# Altium schematic sheet Sheet1.SchDoc
size A3; SheetNumber: 1; SheetTotal: 1
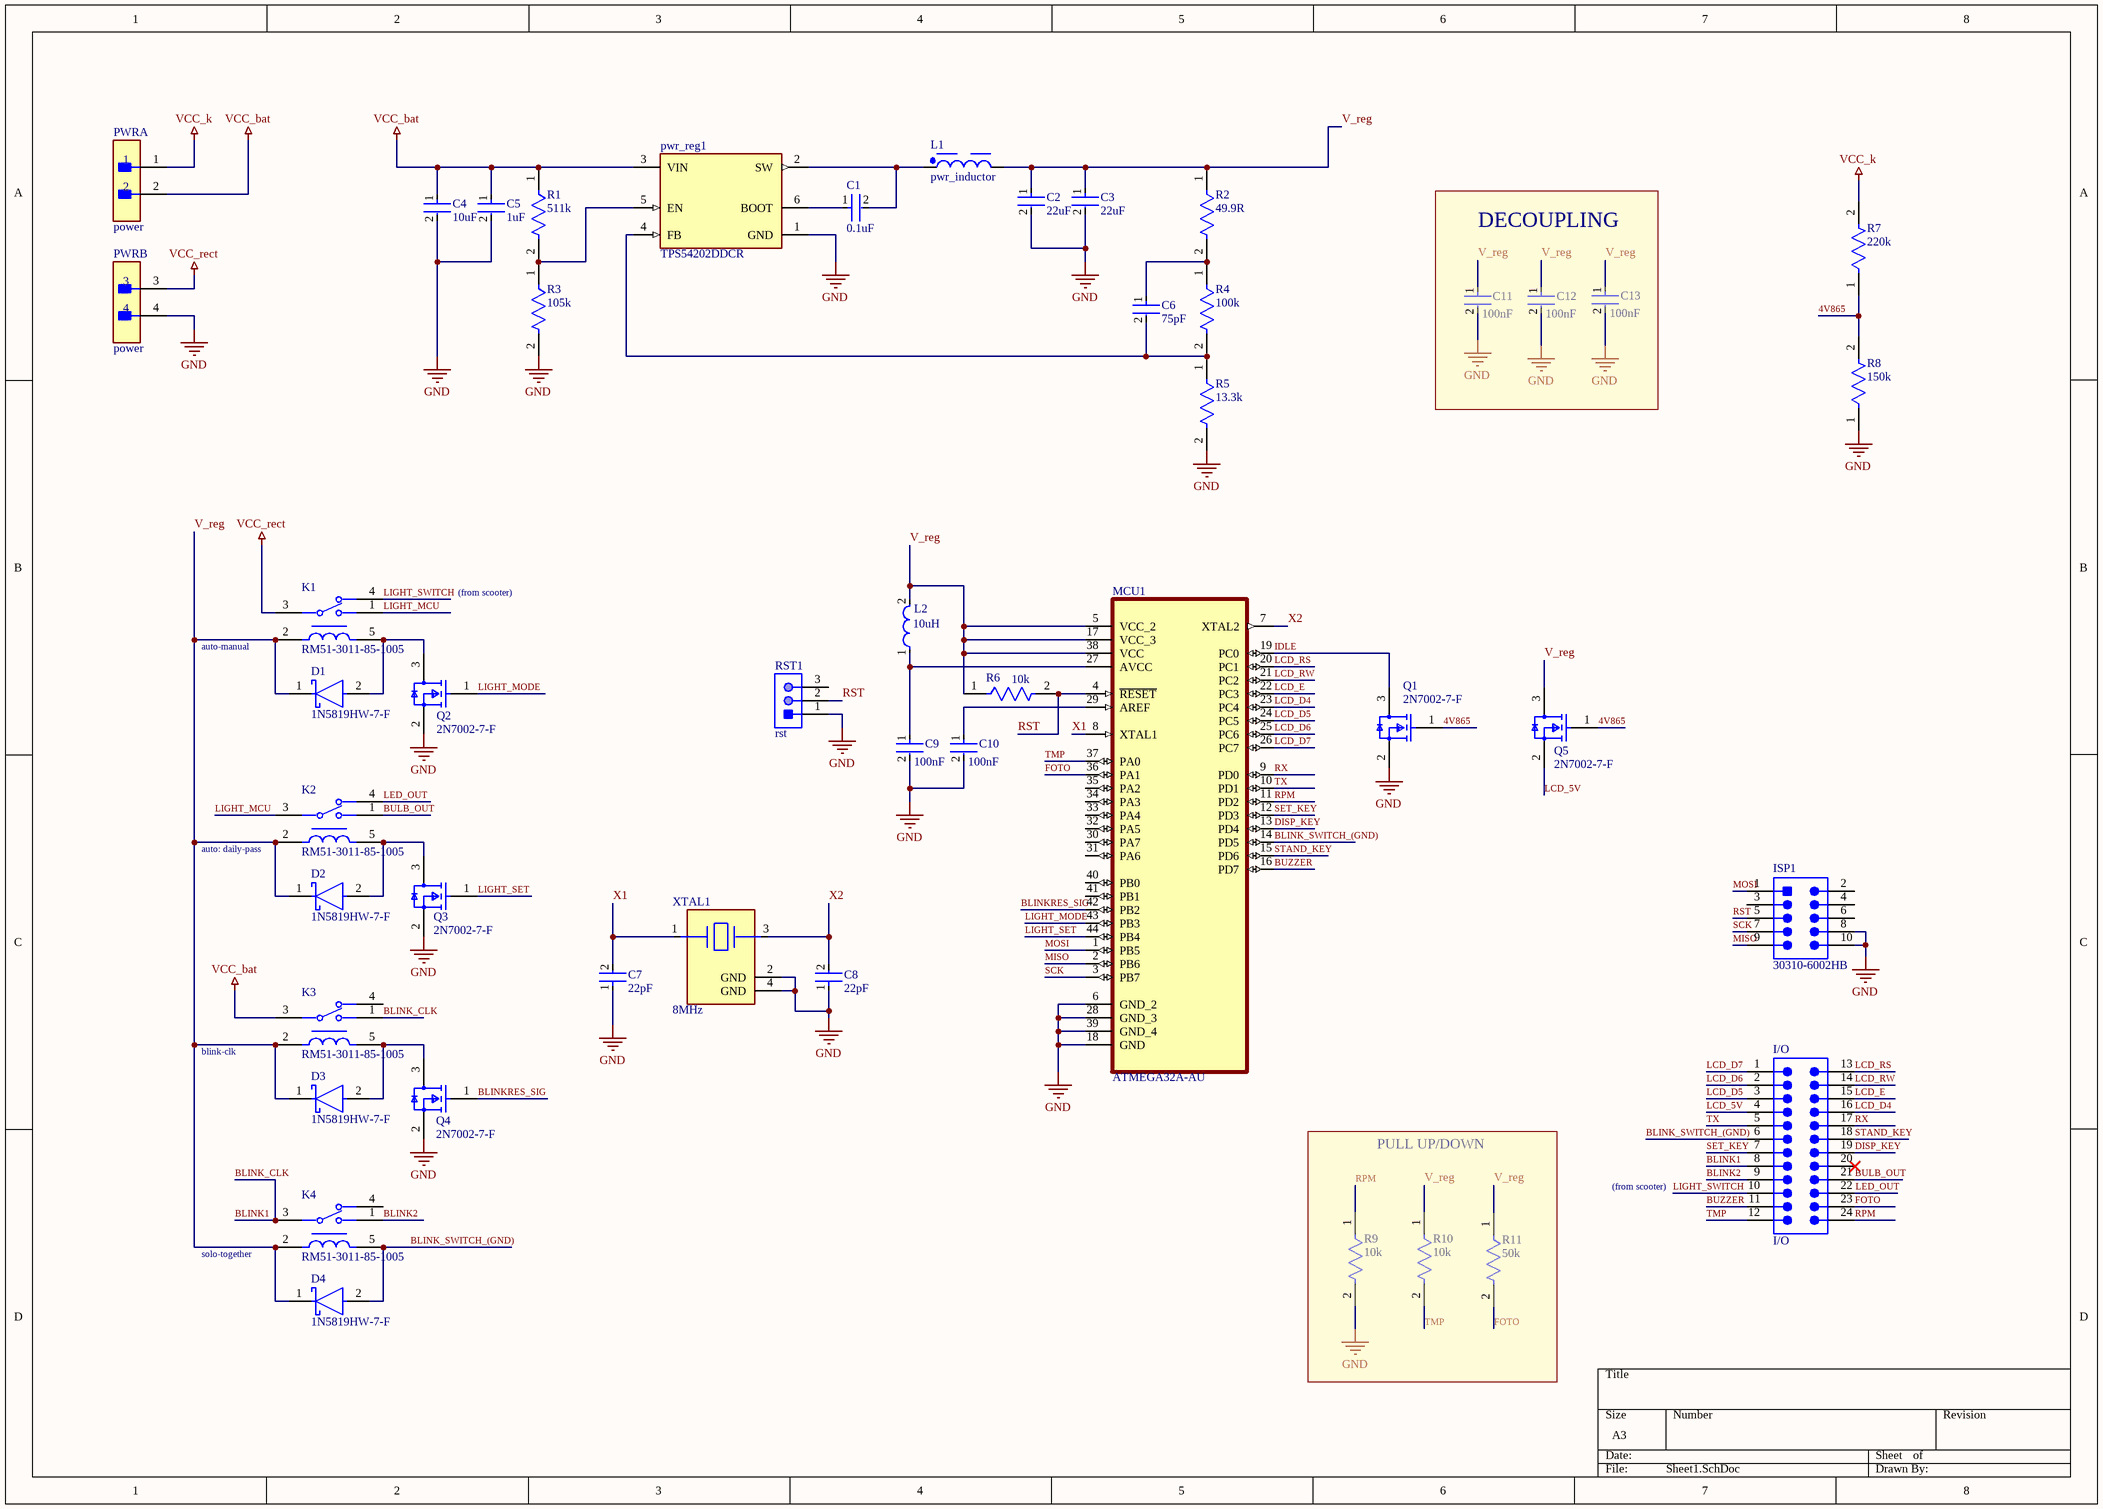
[diagram p0: Sheet1.SchDoc]

## Parts
C1  0.1uF  [FP-CL10-IPC_A]
C2  22uF  [FP-CL10-IPC_A]
C3  22uF  [FP-CL10-IPC_A]
C4  10uF  [FP-CL10-IPC_A]
C5  1uF  [FP-CL10-IPC_A]
C6  75pF  [FP-CL10-IPC_A]
C7  22pF  [FP-CL10-IPC_A]
C8  22pF  [FP-CL10-IPC_A]
C9  100nF  [FP-CL10-IPC_A]
C10  100nF  [FP-CL10-IPC_A]
C11  100nF  [FP-CL10-IPC_A]
C12  100nF  [FP-CL10-IPC_A]
C13  100nF  [FP-CL10-IPC_A]
D1  1N5819HW-7-F  [FP-SOD123-IPC_A]
D2  1N5819HW-7-F  [FP-SOD123-IPC_A]
D3  1N5819HW-7-F  [FP-SOD123-IPC_A]
D4  1N5819HW-7-F  [FP-SOD123-IPC_A]
I/O  I/O  [649024227222]
ISP1  30310-6002HB  [3M-30310-6002HB-10_V]
K1  RM51-3011-85-1005  [FP-1-1721150-0-MFG]
K2  RM51-3011-85-1005  [FP-1-1721150-0-MFG]
K3  RM51-3011-85-1005  [FP-1-1721150-0-MFG]
K4  RM51-3011-85-1005  [FP-1-1721150-0-MFG]
L1  pwr_inductor  [WE-PD_7345]
L2  10uH  [FP-CBMF1608-IPC_A]
MCU1  ATMEGA32A-AU  [QFP80P1200X1200X120-44N]
PWR  power  [FP-1586042-4-MFG]  (parts A,B of 2)
pwr_reg1  TPS54202DDCR  [FP-DDC0006A-IPC_B]
Q1  2N7002-7-F  [FP-SOT23-MFG]
Q2  2N7002-7-F  [FP-SOT23-MFG]
Q3  2N7002-7-F  [FP-SOT23-MFG]
Q4  2N7002-7-F  [FP-SOT23-MFG]
Q5  2N7002-7-F  [FP-SOT23-MFG]
R1  511k  [FP-CRCW0603-e3-IPC_A]
R2  49.9R  [FP-CRCW0603-e3-IPC_A]
R3  105k  [FP-CRCW0603-e3-IPC_A]
R4  100k  [FP-CRCW0603-e3-IPC_A]
R5  13.3k  [FP-CRCW0603-e3-IPC_A]
R6  10k  [FP-CRCW0603-e3-IPC_A]
R7  220k  [FP-CRCW0603-e3-IPC_A]
R8  150k  [FP-CRCW0603-e3-IPC_A]
R9  10k  [FP-CRCW0603-e3-IPC_A]
R10  10k  [FP-CRCW0603-e3-IPC_A]
R11  50k  [FP-CRCW0603-e3-IPC_A]
RST1  rst  [MOLX-22-28-4033_V]
XTAL1  8MHz  [FP-LFXTAL055663REEL-MFG]

## Blocks framed on the sheet
DECOUPLING: C11-C13
PULL UP/DOWN: R9-R11

## Nets
GND: C2.2 C3.2 C4.2 C5.2 C7.1 C8.1 C9.2 C10.2 C11.2 C12.2 C13.2 ISP1.8 ISP1.10 MCU1.6(GND_2) MCU1.18(GND) MCU1.28(GND_3) MCU1.39(GND_4) PWR.4 pwr_reg1.1(GND) Q1.2(S) Q2.2(S) Q3.2(S) Q4.2(S) R3.2 R5.2 R8.1 R9.2 RST1.1 XTAL1.2(GND) XTAL1.4(GND)
VCC_bat: C4.1 C5.1 K3.3 PWR.2 pwr_reg1.3(VIN) R1.1
VCC_k: PWR.1 R7.2
VCC_rect: K1.3 PWR.3
4V865: Q1.1(G) Q5.1(G) R7.1 R8.2
BLINK1: I/O.8 K3.1 K4.3  [also labelled BLINK_CLK]
BLINK2: I/O.9 K4.1
BLINK_SWITCH_(GND): D4.2(A) I/O.6 K4.5 MCU1.14(PD5)
BLINKRES_SIG: MCU1.42(PB2) Q4.1(G)
BULB_OUT: I/O.21 K2.1
BUZZER: I/O.11 MCU1.16(PD7)
DISP_KEY: I/O.19 MCU1.13(PD4)
FOTO: I/O.23 MCU1.36(PA1) R11.2
IDLE: MCU1.19(PC0) Q1.3(D)
LCD_5V: I/O.4 Q5.2(S)
LCD_D4: I/O.16 MCU1.23(PC4)
LCD_D5: I/O.3 MCU1.24(PC5)
LCD_D6: I/O.2 MCU1.25(PC6)
LCD_D7: I/O.1 MCU1.26(PC7)
LCD_E: I/O.15 MCU1.22(PC3)
LCD_RS: I/O.13 MCU1.20(PC1)
LCD_RW: I/O.14 MCU1.21(PC2)
LED_OUT: I/O.22 K2.4
LIGHT_MCU: K1.1 K2.3
LIGHT_MODE: MCU1.43(PB3) Q2.1(G)
LIGHT_SET: MCU1.44(PB4) Q3.1(G)
LIGHT_SWITCH: I/O.10 K1.4
MISO: ISP1.9 MCU1.2(PB6)
MOSI: ISP1.1 MCU1.1(PB5)
RPM: I/O.24 MCU1.11(PD2) R9.1
RST: ISP1.5 MCU1.4(~{RESET}) R6.2 RST1.2
RX: I/O.17 MCU1.9(PD0)
SCK: ISP1.7 MCU1.3(PB7)
SET_KEY: I/O.7 MCU1.12(PD3)
STAND_KEY: I/O.18 MCU1.15(PD6)
TMP: I/O.12 MCU1.37(PA0) R10.2
TX: I/O.5 MCU1.10(PD1)
V_reg: C2.1 C3.1 C11.1 C12.1 C13.1 D1.1(C) D2.1(C) D3.1(C) D4.1(C) K1.2 K2.2 K3.2 K4.2 L1.2 L2.2 MCU1.5(VCC_2) MCU1.17(VCC_3) MCU1.38(VCC) Q5.3(D) R2.1 R6.1 R10.1 R11.1
X1: C7.2 MCU1.8(XTAL1) XTAL1.1(1_CRYSTAL)
X2: C8.2 MCU1.7(XTAL2) XTAL1.3(2_CRYSTAL)
NetC1_1: C1.1 pwr_reg1.6(BOOT)
NetC1_2: C1.2 L1.1 pwr_reg1.2(SW)
NetC6_1: C6.1 R2.2 R4.1
NetC6_2: C6.2 pwr_reg1.4(FB) R4.2 R5.1
NetC9_1: C9.1 L2.1 MCU1.27(AVCC)
NetC10_1: C10.1 MCU1.29(AREF)
NetD1_2: D1.2(A) K1.5 Q2.3(D)
NetD2_2: D2.2(A) K2.5 Q3.3(D)
NetD3_2: D3.2(A) K3.5 Q4.3(D)
Netpwr_reg1_5: pwr_reg1.5(EN) R1.2 R3.1

Not connected (* = marked no-connect by the designer): I/O 20*; ISP1 2 3 4 6; K3 4; K4 4; MCU1 30(PA7) 31(PA6) 32(PA5) 33(PA4) 34(PA3) 35(PA2) 40(PB0) 41(PB1); RST1 3

## Notes on the sheet
- auto-manual
- (from scooter)
- (near K2) auto: daily-pass
- blink-clk
- (near K4) solo-together

## Library data of the parts
C1 = CMP-13271-000587-1: Cap Ceramic 0.1uF 25V SMD 0603; Voltage Rating: 50V; Dielectric: X7R; Tolerance: 10%; Case/Package: 0603; Depth: 0.8mm; Max Operating Temperature: 125°C; Lead Free: Lead Free; Material: Ceramic; Min Operating Temperature: -55°C; Voltage Rating (DC): 50V; Height: 0.8mm; Capacitance: 0.1uF; Thickness: 0.035inch; Radiation Hardening: No; Voltage: 50V; Packaging: Tape and Reel; Length: 1.6mm; Width: 0.031inch; Mount: Surface Mount; Package Quantity: 10000
C2 C3 = CMP-13271-000587-1: Cap Ceramic 22uF 25V X7R LOW ESR SMD 0603; Voltage Rating: 50V; Tolerance: 10%; Case/Package: 0603; Depth: 0.8mm; Max Operating Temperature: 125°C; Lead Free: Lead Free; Material: Ceramic; Min Operating Temperature: -55°C; Voltage Rating (DC): 50V; Dielectric: X7R; Height: 0.8mm; Capacitance: 22uF; Thickness: 0.035inch; Radiation Hardening: No; Voltage: 50V; Packaging: Tape and Reel; Length: 1.6mm; Width: 0.031inch; Mount: Surface Mount; Package Quantity: 10000
C4 = CMP-13271-000587-1: Cap Ceramic 10uF 25V SMD 0603; Voltage Rating: 50V; Dielectric: X7R; Tolerance: 10%; Case/Package: 0603; Depth: 0.8mm; Max Operating Temperature: 125°C; Lead Free: Lead Free; Material: Ceramic; Min Operating Temperature: -55°C; Voltage Rating (DC): 50V; Height: 0.8mm; Capacitance: 10uF; Thickness: 0.035inch; Radiation Hardening: No; Voltage: 50V; Packaging: Tape and Reel; Length: 1.6mm; Width: 0.031inch; Mount: Surface Mount; Package Quantity: 10000
C5 = CMP-13271-000587-1: Cap Ceramic 1uF 25V SMD 0603; Voltage Rating: 50V; Dielectric: X7R; Tolerance: 10%; Case/Package: 0603; Depth: 0.8mm; Max Operating Temperature: 125°C; Lead Free: Lead Free; Material: Ceramic; Min Operating Temperature: -55°C; Voltage Rating (DC): 50V; Height: 0.8mm; Capacitance: 1uF; Thickness: 0.035inch; Radiation Hardening: No; Voltage: 50V; Packaging: Tape and Reel; Length: 1.6mm; Width: 0.031inch; Mount: Surface Mount; Package Quantity: 10000
C6 = CMP-13271-000587-1: Cap Ceramic 75pF 25V SMD 0603; Voltage Rating: 50V; Dielectric: X7R; Tolerance: 10%; Case/Package: 0603; Depth: 0.8mm; Max Operating Temperature: 125°C; Lead Free: Lead Free; Material: Ceramic; Min Operating Temperature: -55°C; Voltage Rating (DC): 50V; Height: 0.8mm; Capacitance: 75pF; Thickness: 0.035inch; Radiation Hardening: No; Voltage: 50V; Packaging: Tape and Reel; Length: 1.6mm; Width: 0.031inch; Mount: Surface Mount; Package Quantity: 10000
C7 C8 = CMP-13271-000587-1: Cap Ceramic 22pF 25V SMD 0603; Voltage Rating: 50V; Dielectric: X7R; Tolerance: 10%; Case/Package: 0603; Depth: 0.8mm; Max Operating Temperature: 125°C; Lead Free: Lead Free; Material: Ceramic; Min Operating Temperature: -55°C; Voltage Rating (DC): 50V; Height: 0.8mm; Capacitance: 22pF; Thickness: 0.035inch; Radiation Hardening: No; Voltage: 50V; Packaging: Tape and Reel; Length: 1.6mm; Width: 0.031inch; Mount: Surface Mount; Package Quantity: 10000
C9-C13 = CMP-13271-000587-1: Cap Ceramic 100nF 50V X7R ±10% Pad SMD 0603 +125°C T/R; Case/Package: 0603; Depth: 0.8mm; Max Operating Temperature: 125°C; Lead Free: Lead Free; Material: Ceramic; Voltage Rating: 50V; Min Operating Temperature: -55°C; Voltage Rating (DC): 50V; Dielectric: X7R; Height: 0.8mm; Capacitance: 100nF; Thickness: 0.035inch; Radiation Hardening: No; Voltage: 50V; Packaging: Tape and Reel; Length: 1.6mm; Tolerance: 10%; Width: 0.031inch; Mount: Surface Mount; Package Quantity: 10000
D1-D4 = CMP-0303-00003-3: DIODE SCHOTTKY 40V 1A SOD123; Forward Voltage: 450mV; Capacitance: 110pF; Max Forward Surge Current (Ifsm): 25A; Peak Reverse Current: 50uA; Polarity: Standard; Element Configuration: Single; Max Power Dissipation: 450mW; Min Operating Temperature: -65°C; Package Quantity: 3000; Contact Plating: Tin; Weight: 0.000353oz; Max Repetitive Reverse Voltage (Vrrm): 40V; Max Reverse Voltage (DC): 40V; Height: 1.25mm; Average Rectified Current: 1A; Width: 1.7mm; Case/Package: SOD-123-2; Lead Free: Lead Free; Max Operating Temperature: 125°C; Current Rating: 1A; Termination: SMD/SMT; Forward Current: 1A; Radiation Hardening: No; Number of Pins: 2; Length: 2.85mm; Voltage Rating (DC): 40V; REACH SVHC: No SVHC; Peak Non-Repetitive Surge Current: 25A; Packaging: Tape and Reel; Output Current: 1A
I/O = CMP-1502-00539-2: NexarPartId: 23024662; Pitch: 4.2mm; Number of Contacts: 24; Operating Supply Voltage: 600V; Contact Resistance: 10mΩ; Row Spacing: 4.191mm; Current Rating: 6A; Connector Type: Male Pin, Socket; Insulation Resistance: 1GΩ; Gender: Male; Contact Plating: Tin; Max Operating Temperature: 105°C; Length: 51.6mm; Color: White; Termination: Solder; Number of Pins: 24; Lead Pitch: 4.2mm; Number of Positions: 24; REACH SVHC: Unknown; Contact Material: Copper; Fastening Type: Ramp; Number of Rows: 2; Height: 12.8mm; Min Operating Temperature: -40°C; RoHS: Compliant; Mount: Through Hole; Width: 51.7mm
ISP1 = CMP-2000-05031-1: Male Header, Pitch 2.54 mm, 2 x 5 Position, Height 9.3 mm, Tail Length 2.79 mm, -55 to 105 degC, RoHS, Bulk; Manufacturer: 3M; Current Rating: 1A; Brand: 3MElectronicSolutionsDivision; Mounting Angle: Straight; Number of Positions: 10Position; Mating Post Length: 5.99mm; Pitch: 2.54mm; Manufacturer URL: http://www.3m.com/; Factory Pack Quantity: 1000; Mounting Style: StraightPin; Number of Rows: 2Row; Termination Post Length: 2.79mm; Contact Gender: Pin(Male); Contact Material: Brass; Termination Style: ThroughHole; Product: Headers; Packaging: Tray; Product Category: Headers&WireHousings; Type: Shrouded; Datasheet URL: http://datasheet.octopart.com/30310-6002HB-3M-datasheet-11537585.pdf; Datasheet Version: Apr-12; Contact Plating: Gold; Row Spacing: 2.54mm; Housing Material: Polyester; Series: 303; RoHS: Details
K1-K4 = CMP-03395-000112-1: Relpol / RM51-3011-85-1005 / RELAY 10A 5V; Manufacturer: TE; Manufacturer Part Number: 1-1721150-0; Throw Configuration: SPDT; Coil Power: 360mW; Coil Resistance: 70Ω; Coil Type: Non-Latching; Number Of Contacts: 1; Standoff Height: 0.2mm; Device Class L1: Electromechanical; Device Class L3: Power Relays; ComponentLink2Description: Datasheet; RoHS: TRUE; Automotive: No; Octopart: https://octopart.com/1-1721150-0-te+connectivity-41294869; Switching Current: 10A; Ambient Temperature Range Low: -30°C; ComponentLink2URL: https://www.te.com/usa-en/product-1-1721150-0.html?te_bu=Cor&te_type=other&te_campaign=oct_glo_cor-oct-global-oth-prtnr-fy19-oct-octo-buy-bom_sma-298_2&elqCampaignId=35216; Package: 1-1721150-0; Height: 16.3mm; Lead Free: Yes; Digikey Description: RELAY GEN PURPOSE SPDT 10A 5V; Category: Relay; Ambient Temperature Range High: +70°C; Device Class L2: Relays; Current Rating: 10A; Coil Voltage: 5V
L1 = CMP-0227-00155-2: 15uF, 2.7A  HPI0630-150; NexarPartId: 31136509; Self Resonant Frequency: 9.5MHz; Inductance: 15µH; Tolerance: 20%; DC Resistance (DCR): 110mΩ; Shielding: Shielded; Ambient Temperature Range Low: -40°C; Depth: 7.3mm; Max Operating Temperature: 125°C; Length: 7.3mm; Max DC Current: 2.7A; Height: 4.5mm; Current Rating: 2.7A; Width: 7.3mm; Number of Pins: 2; Min Operating Temperature: -40°C; Ambient Temperature Range High: 85°C; RoHS: Compliant; Packaging: Tape & Reel
L2 = CMP-14484-000247-1: SMD Inductors 10uH ±10% 0.38A 0.468Ω 0603; Saturation Current: 115mA; Max DC Current: 380mA; DC Resistance (DCR): 468mR; Shielding: Unshielded; Core Material: Ferrite; Self Resonant Frequency: 32MHz; Test Frequency: 2.52MHz; RoHS Compliant: Yes; Case Code (Metric): 1608; Height: 0.8mm; Inductance Tolerance: 10%; Series: CB; Packaging: Tape and Reel; Width: 0.031inch; Case Code (Imperial): 0603; Tolerance: 10%; Radiation Hardening: No; Inductance: 10uH; Resistor Type: Wirewound; Termination: SMD/SMT; Height - Seated (Max): 0.039inch; Mount: Surface Mount; Halogen Free: Halogen Free; Min Operating Temperature: -40°C; Current Rating: 380mA; Lead Free: Lead Free; DC Current: 380mA; Package Quantity: 3000; Case/Package: 0603; Length: 0.063inch; Max Operating Temperature: 105°C; Depth: 1mm; Military Standard: Not
MCU1 = ATMEGA32A-AU: AVR AVRÂ® ATmega Microcontroller IC 8-Bit 16MHz 32KB (16K x 16) FLASH 44-TQFP (10x10); MF: Microchip; SnapEDA_Link: https://www.snapeda.com/parts/ATMEGA32A-AU/Microchip/view-part/?ref=snap; Package: TQFP-44 Microchip; Value: *; MP: ATMEGA32A-AU; Check_prices: https://www.snapeda.com/parts/ATMEGA32A-AU/Microchip/view-part/?ref=eda
PWR = CMP-03369-000114-1: CONN HEADER R/A 4POS 4.2MM; VDE Tested: No; PCB Mount Alignment: No (Without); Max Voltage Rating (AC): 600V; Contact Current Rating: 9A; Number of Contacts: 4; Plating Thickness: 78.73um; PCB Mount Retention: Without; Insulation Diameter: 0.122inch; Number of Ports: 1; Connector Type: Pin; Mating Alignment: Yes (With); Connector System: Wire-to-Board; Row Spacing: 4.2inch; PCB Mounting Orientation: Right Angle; Approvals: CSA; PCB Thickness: 0.063mm; Circuit Application: Power; Length: 9.6mm; Contact Type: Male Pin; Sealable: No (Without); Series: VAL-U-LOK; Mount: Through Hole; Height: 0.386inch; Radiation Hardening: No; Pitch: 4.2mm; Number of Positions: 4; Contact Material: Brass; Max Operating Temperature: 221°C; Number of Terminals/Pins: 4; Housing Material: Nylon; Number of Circuits: 4; Min Operating Temperature: -40°C; Voltage Rating: 600V; ELV: Compliant; Selectively Loaded: No (Without); Current Rating: 9A; Packaging: Tray; Number of Power Positions: 4; Width: 13mm; Number of Rows: 2; Housing Color: Natural; RoHS Compliant: Yes; Termination: Solder; Package Quantity: 400; Contact Retention: No (Without); Lead Free: Lead Free; Orientation: Right Angle; Fastening Type: Ramp; Mating Retention: Yes (With); Flammability Rating: UL94 V-0; Contact Plating: Tin
pwr_reg1 = CMP-04918-000439-1: IC REG BUCK ADJ 2A TSOT23-6; Switching Frequency: 500kHz; Quiescent Current: 40uA; Max Output Voltage: 28V; Output Configuration: Positive; Min Output Voltage: 596mV; Min Input Voltage: 4.5V; Synchronous Rectifier: Yes; Output Type: Adjustable; Number of Outputs: 1; Packaging: Tape and Reel; Case/Package: SOT-23-6; RoHS Compliant: Yes; Max Input Voltage: 28V; Max Operating Temperature: 125°C; Min Operating Temperature: -40°C; Output Current: 2A; Lead Free: Lead Free; Mount: Surface Mount
Q1-Q5 = CMP-2000-04929-2: MOSFET N-CH 60V 115MA SOT23-3; Turn-On Delay Time: 7ns; Turn-Off Delay Time: 11ns; Drain to Source Resistance: 7.5R; Rise Time: 3ns; Drain to Source Breakdown Voltage: 70V; Input Capacitance: 50pF; Number of Elements: 1; Power Dissipation: 540mW; Max Power Dissipation: 300mW; Fall Time: 5.6ns; Gate to Source Voltage (Vgs): 20V; Threshold Voltage: 2.5V; Element Configuration: Single; Termination: SMD/SMT; Weight: 0.000282oz; Radiation Hardening: No; Max Operating Temperature: 150°C; On-State Resistance: 7.5R; Mount: Surface Mount; Current Rating: 115mA; Contact Plating: Tin; Lead Free: Lead Free; Min Operating Temperature: -55°C; Number of Pins: 3; REACH SVHC: No SVHC; Drain to Source Voltage (Vdss): 60V; Width: 1.3mm; Package Quantity: 3000; Length: 2.9mm; Case/Package: SOT-23; Number of Channels: 1; Dual Supply Voltage: 60V; Packaging: Tape and Reel; Height: 1mm; Voltage Rating (DC): 60V; Nominal Vgs: 2.5V; Continuous Drain Current (ID): 115mA; Voltage: 60V; Rds On Max: 7.5R
R1 = CMP-2000-03245-2: 511kΩ, 0.1W, 0603; Voltage Rating: 75V; Tolerance: 1%; Max Power Dissipation: 100mW; Temperature Coefficient: 100ppm/°C; Contact Plating: Tin; Min Operating Temperature: -55°C; Radiation Hardening: No; Package Quantity: 10; Resistance: 511k; Termination: SMD/SMT; Case Code (Metric): 1608; Military Standard: Not; Packaging: Tape and Reel; Case/Package: 0603; Composition: Thick Film; Depth: 0.85mm; Weight: 7.1E-05oz; Max Operating Temperature: 155°C; Height: 0.45mm; Features: Automotive AEC-Q200; Width: 0.033inch; Length: 1.55mm; Power Rating: 100mW; Voltage Rating (DC): 75V; Case Code (Imperial): 0603; Mount: Surface Mount; Number of Terminations: 2; Lead Free: Lead Free
R2 = CMP-2000-03245-2: 49.9Ω, 0.1W, 0603; Voltage Rating: 75V; Tolerance: 1%; Resistance: 49.9; Max Power Dissipation: 100mW; Temperature Coefficient: 100ppm/°C; Contact Plating: Tin; Min Operating Temperature: -55°C; Radiation Hardening: No; Package Quantity: 10; Termination: SMD/SMT; Case Code (Metric): 1608; Military Standard: Not; Packaging: Tape and Reel; Case/Package: 0603; Composition: Thick Film; Depth: 0.85mm; Weight: 7.1E-05oz; Max Operating Temperature: 155°C; Height: 0.45mm; Features: Automotive AEC-Q200; Width: 0.033inch; Length: 1.55mm; Power Rating: 100mW; Voltage Rating (DC): 75V; Case Code (Imperial): 0603; Mount: Surface Mount; Number of Terminations: 2; Lead Free: Lead Free
R3 = CMP-2000-03245-2: 105kΩ, 0.1W, 0603; Voltage Rating: 75V; Tolerance: 1%; Max Power Dissipation: 100mW; Temperature Coefficient: 100ppm/°C; Contact Plating: Tin; Min Operating Temperature: -55°C; Radiation Hardening: No; Package Quantity: 10; Resistance: 105k; Termination: SMD/SMT; Case Code (Metric): 1608; Military Standard: Not; Packaging: Tape and Reel; Case/Package: 0603; Composition: Thick Film; Depth: 0.85mm; Weight: 7.1E-05oz; Max Operating Temperature: 155°C; Height: 0.45mm; Features: Automotive AEC-Q200; Width: 0.033inch; Length: 1.55mm; Power Rating: 100mW; Voltage Rating (DC): 75V; Case Code (Imperial): 0603; Mount: Surface Mount; Number of Terminations: 2; Lead Free: Lead Free
R4 = CMP-2000-03245-2: 100kΩ, 0.1W, 0603; Voltage Rating: 75V; Tolerance: 1%; Max Power Dissipation: 100mW; Temperature Coefficient: 100ppm/°C; Contact Plating: Tin; Min Operating Temperature: -55°C; Radiation Hardening: No; Package Quantity: 10; Resistance: 100k; Termination: SMD/SMT; Case Code (Metric): 1608; Military Standard: Not; Packaging: Tape and Reel; Case/Package: 0603; Composition: Thick Film; Depth: 0.85mm; Weight: 7.1E-05oz; Max Operating Temperature: 155°C; Height: 0.45mm; Features: Automotive AEC-Q200; Width: 0.033inch; Length: 1.55mm; Power Rating: 100mW; Voltage Rating (DC): 75V; Case Code (Imperial): 0603; Mount: Surface Mount; Number of Terminations: 2; Lead Free: Lead Free
R5 = CMP-2000-03245-2: 13.3kΩ, 0.1W, 0603; Voltage Rating: 75V; Tolerance: 1%; Max Power Dissipation: 100mW; Temperature Coefficient: 100ppm/°C; Contact Plating: Tin; Min Operating Temperature: -55°C; Radiation Hardening: No; Package Quantity: 10; Resistance: 13.3k; Termination: SMD/SMT; Case Code (Metric): 1608; Military Standard: Not; Packaging: Tape and Reel; Case/Package: 0603; Composition: Thick Film; Depth: 0.85mm; Weight: 7.1E-05oz; Max Operating Temperature: 155°C; Height: 0.45mm; Features: Automotive AEC-Q200; Width: 0.033inch; Length: 1.55mm; Power Rating: 100mW; Voltage Rating (DC): 75V; Case Code (Imperial): 0603; Mount: Surface Mount; Number of Terminations: 2; Lead Free: Lead Free
R6 R9 R10 = CMP-2000-03245-2: 10kΩ, 0.1W, 0603; Voltage Rating: 75V; Tolerance: 1%; Max Power Dissipation: 100mW; Temperature Coefficient: 100ppm/°C; Contact Plating: Tin; Min Operating Temperature: -55°C; Radiation Hardening: No; Package Quantity: 10; Resistance: 10k; Termination: SMD/SMT; Case Code (Metric): 1608; Military Standard: Not; Packaging: Tape and Reel; Case/Package: 0603; Composition: Thick Film; Depth: 0.85mm; Weight: 7.1E-05oz; Max Operating Temperature: 155°C; Height: 0.45mm; Features: Automotive AEC-Q200; Width: 0.033inch; Length: 1.55mm; Power Rating: 100mW; Voltage Rating (DC): 75V; Case Code (Imperial): 0603; Mount: Surface Mount; Number of Terminations: 2; Lead Free: Lead Free
R7 = CMP-2000-03245-2: 220kΩ, 0.1W, 0603; Voltage Rating: 75V; Tolerance: 1%; Resistance: 10k; Max Power Dissipation: 100mW; Temperature Coefficient: 100ppm/°C; Contact Plating: Tin; Min Operating Temperature: -55°C; Radiation Hardening: No; Package Quantity: 10; Termination: SMD/SMT; Case Code (Metric): 1608; Military Standard: Not; Packaging: Tape and Reel; Case/Package: 0603; Composition: Thick Film; Depth: 0.85mm; Weight: 7.1E-05oz; Max Operating Temperature: 155°C; Height: 0.45mm; Features: Automotive AEC-Q200; Width: 0.033inch; Length: 1.55mm; Power Rating: 100mW; Voltage Rating (DC): 75V; Case Code (Imperial): 0603; Mount: Surface Mount; Number of Terminations: 2; Lead Free: Lead Free
R8 = CMP-2000-03245-2: 150kΩ, 0.1W, 0603; Voltage Rating: 75V; Tolerance: 1%; Resistance: 10k; Max Power Dissipation: 100mW; Temperature Coefficient: 100ppm/°C; Contact Plating: Tin; Min Operating Temperature: -55°C; Radiation Hardening: No; Package Quantity: 10; Termination: SMD/SMT; Case Code (Metric): 1608; Military Standard: Not; Packaging: Tape and Reel; Case/Package: 0603; Composition: Thick Film; Depth: 0.85mm; Weight: 7.1E-05oz; Max Operating Temperature: 155°C; Height: 0.45mm; Features: Automotive AEC-Q200; Width: 0.033inch; Length: 1.55mm; Power Rating: 100mW; Voltage Rating (DC): 75V; Case Code (Imperial): 0603; Mount: Surface Mount; Number of Terminations: 2; Lead Free: Lead Free
R11 = CMP-2000-03245-2: 50kΩ, 0.1W, 0603; Voltage Rating: 75V; Tolerance: 1%; Resistance: 10k; Max Power Dissipation: 100mW; Temperature Coefficient: 100ppm/°C; Contact Plating: Tin; Min Operating Temperature: -55°C; Radiation Hardening: No; Package Quantity: 10; Termination: SMD/SMT; Case Code (Metric): 1608; Military Standard: Not; Packaging: Tape and Reel; Case/Package: 0603; Composition: Thick Film; Depth: 0.85mm; Weight: 7.1E-05oz; Max Operating Temperature: 155°C; Height: 0.45mm; Features: Automotive AEC-Q200; Width: 0.033inch; Length: 1.55mm; Power Rating: 100mW; Voltage Rating (DC): 75V; Case Code (Imperial): 0603; Mount: Surface Mount; Number of Terminations: 2; Lead Free: Lead Free
RST1 = CMP-1676-00001-5: Male Header, Pitch 2.54 mm, 1 x 3 Position, Height 8.38 mm, Tail Length 3.18 mm, RoHS, Bulk; Manufacturer: Molex; Rows: 1; Voltage Rating: 250 V; Current Rating: 4 A; Min Operating Temperature: 0 degC; Lead Pitch: 0.1 inch; Packaging: Bulk; Contact Finish: Gold; RoHSCompliant: true; Contact Material: Brass; PackageReference: 22-28-4033; REACH SVHC: Unknown; PackageDescription: Male Header, Pitch 2.54 mm, 1 x 3 Position, Height 8.38 mm, Tail Length 3.18 mm; ComponentLink2URL: http://www.molex.com/pdm_docs/sd/022284033_sd.pdf; Height: 8.38 mm; Mounting Technology: Through Hole; ComponentLink1Description: Manufacturer URL; Length: 7.62 mm; Mount: Through Hole; DatasheetVersion: Rev. G, 01/2012; Max Operating Temperature: 75 degC; ComponentLink2Description: Datasheet; Colour: Black; Pins: 3; Contact Plating: Gold; Package Quantity: 1; ComponentLink1URL: http://www.molex.com/
XTAL1 = CMP-96504-000007-1: LFXTAL055663REEL / CRYSTAL 8.0000MHZ 18PF SMD; RoHS Compliant: Yes